# Altium schematic sheet RK3588_OSC_PLL.SchDoc
size 594 x 420 mm; SheetNumber: 3; SheetTotal: 23
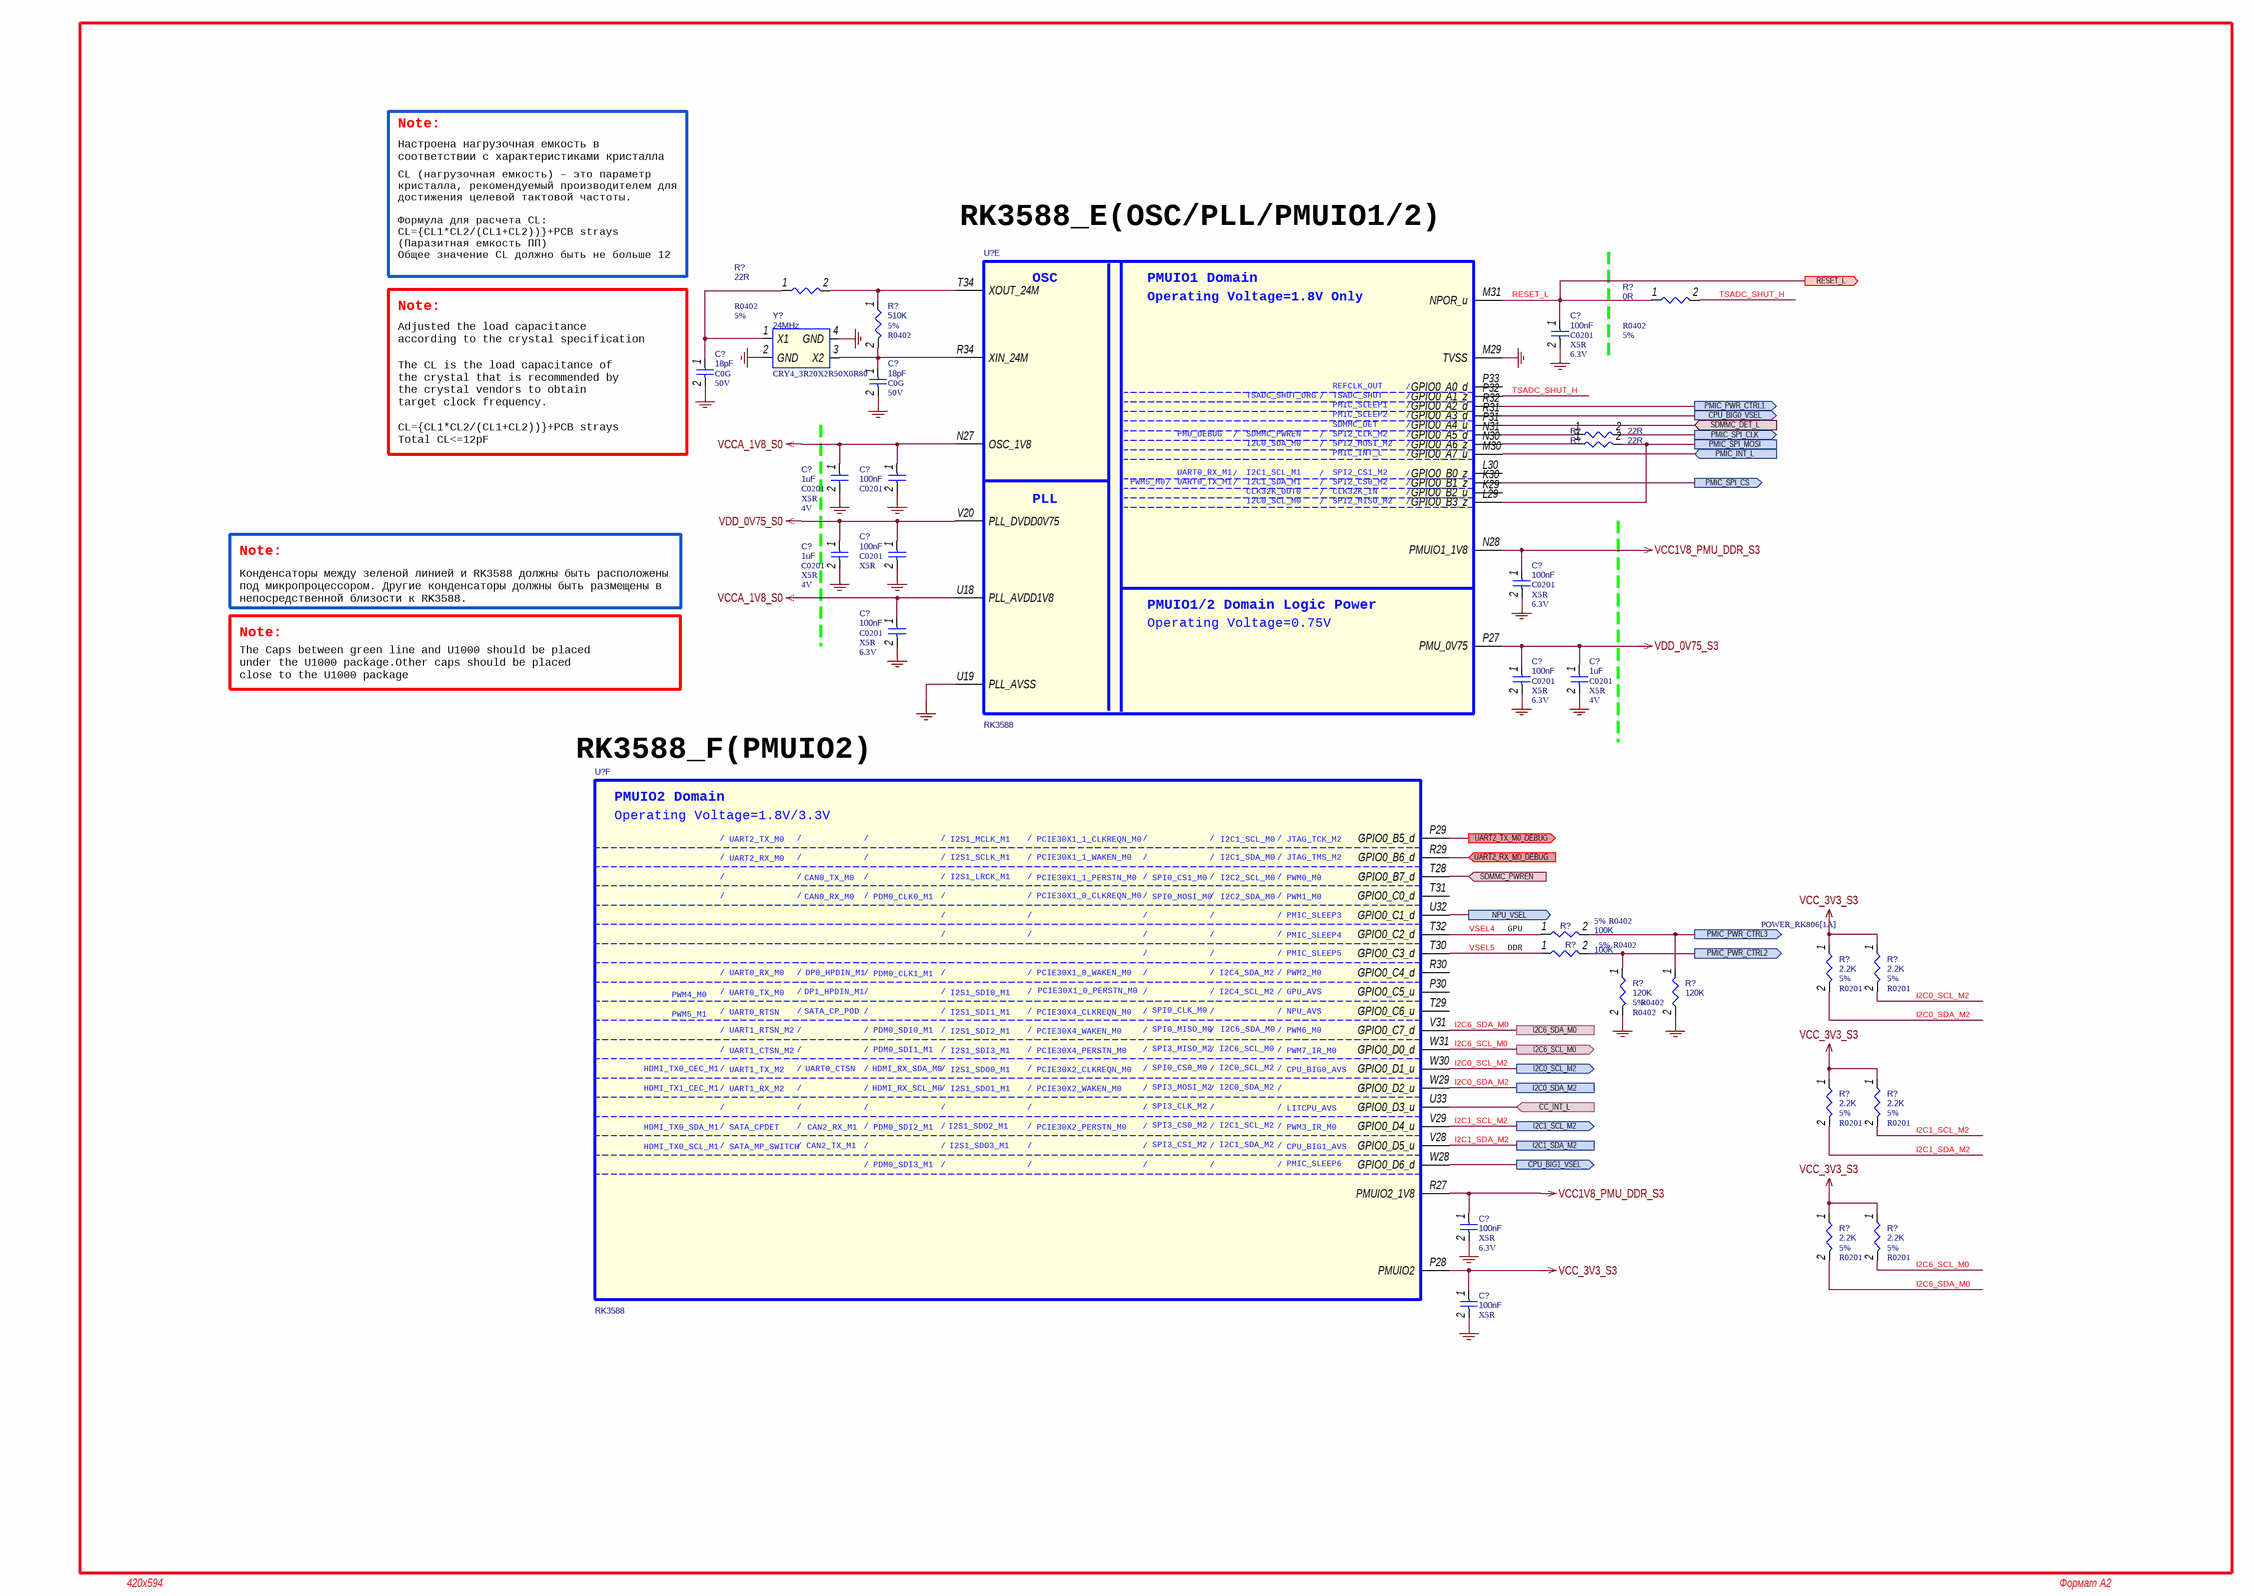
[diagram p0: RK3588_OSC_PLL.SchDoc]

## Parts
(Parts that share a designator on the sheet are numbered #1, #2 ... from top to bottom, then left to right.)
C?#1  100nF  Dielectric: X5R  Voltage: 6.3V  [C0201]
C?#2  18pF  Dielectric: C0G  Voltage: 50V  [C0402]
C?#3  18pF  Dielectric: C0G  Voltage: 50V  [C0402]
C?#4  1uF  Dielectric: X5R  Voltage: 4V  [C0201]
C?#5  100nF  [C0201]
C?#6  1uF  Dielectric: X5R  Voltage: 4V  [C0201]
C?#7  100nF  Dielectric: X5R  [C0201]
C?#8  100nF  Dielectric: X5R  Voltage: 6.3V  [C0201]
C?#9  100nF  Dielectric: X5R  Voltage: 6.3V  [C0201]
C?#10  100nF  Dielectric: X5R  Voltage: 6.3V  [C0201]
C?#11  1uF  Dielectric: X5R  Voltage: 4V  [C0201]
C?#12  100nF  Dielectric: X5R  Voltage: 6.3V  [C0201]
C?#13  100nF  Dielectric: X5R  [C0201]
R?#1  22R  Tolerance: 5%  [R0402]
R?#2  510K  Tolerance: 5%  [R0402]
R?#3  0R  Tolerance: 5%  [R0402]
R?#4  22R  [R0402]
R?#5  22R  [R0402]
R?#6  100K  Tolerance: 5%  [R0402]
R?#7  2.2K  Tolerance: 5%  PCB Footprint: R0201  [R0402]
R?#8  2.2K  Tolerance: 5%  PCB Footprint: R0201  [R0402]
R?#9  100K  Tolerance: 5%  [R0402]
R?#10  120K  Tolerance: 5%  [R0402]
R?#11  120K  [R0402]
R?#12  2.2K  Tolerance: 5%  PCB Footprint: R0201  [R0402]
R?#13  2.2K  Tolerance: 5%  PCB Footprint: R0201  [R0402]
R?#14  2.2K  Tolerance: 5%  PCB Footprint: R0201  [R0402]
R?#15  2.2K  Tolerance: 5%  PCB Footprint: R0201  [R0402]
U?#1  RK3588  [BGA1088_23R00X23R00X2R00]  (part E of 26)
U?#2  RK3588  [BGA1088_23R00X23R00X2R00]  (part F of 26)
Y?  24MHz  PCB Footprint: CRY4_3R20X2R50X0R80  [CRY-3225]

## Ports
CC_INT_L (in, see PORT_TYPE_C[2D]), CPU_BIG0_VSEL (out, see POWER_RK806[1A]), CPU_BIG1_VSEL (out, see POWER_RK806[1A]), I2C0_SCL_M2 (out, see POWER_RK806[1A]), I2C0_SDA_M2 (see POWER_RK806[1A]), I2C1_SCL_M2 (out, see POWER_RK806[1A]), I2C1_SDA_M2 (see POWER_RK806[1A]), I2C6_SCL_M0 (out, see PORT_TYPE_C[2D]), I2C6_SDA_M0 (see PORT_TYPE_C[2D]), NPU_VSEL (out, see POWER_RK806[1A]), PMIC_INT_L (in, see POWER_RK806[1A]), PMIC_PWR_CTRL1 (out, see POWER_RK806[1A]), PMIC_PWR_CTRL2 (out, see POWER_RK806[1A]), PMIC_PWR_CTRL3 (out, see POWER_RK806[1A]), PMIC_SPI_CLK (out, see POWER_RK806[1A]), PMIC_SPI_CS (out, see POWER_RK806[1A]), PMIC_SPI_MOSI (see POWER_RK806[1A]), RESET_L (out, see BUTTON[2B], POWER_RK806[1A]), SDMMC_DET_L (in, see FLASH_SD_CARD[2C]), SDMMC_PWREN (in, see FLASH_SD_CARD[2A]), UART2_RX_M0_DEBUG (in, see UART_DEBUG[2B]), UART2_TX_M0_DEBUG (out, see UART_DEBUG[2B])

## Nets
GND: C?#1.2 C?#2.2 C?#3.2 C?#4.2 C?#5.2 C?#6.2 C?#7.2 C?#8.2 C?#9.2 C?#10.2 C?#11.2 C?#12.2 C?#13.2 R?#10.2 R?#11.2 U?#1.M29(TVSS) U?#1.U19(PLL_AVSS) Y?.2(GND) Y?.4(GND)
VCC1V8_PMU_DDR_S3: C?#8.1 C?#12.1 U?#1.N28(PMUIO1_1V8) U?#2.R27(PMUIO2_1V8)
VCC_3V3_S3: C?#13.1 R?#7.1 R?#8.1 R?#12.1 R?#13.1 R?#14.1 R?#15.1 U?#2.P28(PMUIO2)
VCCA_1V8_S0: C?#4.1 C?#5.1 C?#9.1 U?#1.N27(OSC_1V8) U?#1.U18(PLL_AVDD1V8)
VDD_0V75_S0: C?#6.1 C?#7.1 U?#1.V20(PLL_DVDD0V75)
VDD_0V75_S3: C?#10.1 C?#11.1 U?#1.P27(PMU_0V75)
CC_INT_L: U?#2.U33(GPIO0_D3_u) ; port CC_INT_L
CPU_BIG0_VSEL: U?#1.R31(GPIO0_A3_d) ; port CPU_BIG0_VSEL
CPU_BIG1_VSEL: U?#2.W28(GPIO0_D6_d) ; port CPU_BIG1_VSEL
I2C0_SCL_M2: R?#8.2 U?#2.W30(GPIO0_D1_u) ; port I2C0_SCL_M2
I2C0_SDA_M2: R?#7.2 U?#2.W29(GPIO0_D2_u) ; port I2C0_SDA_M2
I2C1_SCL_M2: R?#13.2 U?#2.V29(GPIO0_D4_u) ; port I2C1_SCL_M2
I2C1_SDA_M2: R?#12.2 U?#2.V28(GPIO0_D5_u) ; port I2C1_SDA_M2
I2C6_SCL_M0: R?#15.2 U?#2.W31(GPIO0_D0_d) ; port I2C6_SCL_M0
I2C6_SDA_M0: R?#14.2 U?#2.V31(GPIO0_C7_d) ; port I2C6_SDA_M0
NPU_VSEL: U?#2.U32(GPIO0_C1_d) ; port NPU_VSEL
PMIC_INT_L: U?#1.M30(GPIO0_A7_u) ; port PMIC_INT_L
PMIC_PWR_CTRL1: U?#1.R32(GPIO0_A2_d) ; port PMIC_PWR_CTRL1
PMIC_PWR_CTRL2: R?#9.2 R?#10.1 ; port PMIC_PWR_CTRL2
PMIC_PWR_CTRL3: R?#6.2 R?#11.1 ; port PMIC_PWR_CTRL3
PMIC_SPI_CLK: R?#4.2 ; port PMIC_SPI_CLK
PMIC_SPI_CS: U?#1.K30(GPIO0_B1_z) ; port PMIC_SPI_CS
PMIC_SPI_MOSI: R?#5.2 U?#1.L29(GPIO0_B3_z) ; port PMIC_SPI_MOSI
RESET_L: C?#1.1 R?#3.1 U?#1.M31(NPOR_u) ; port RESET_L
SDMMC_DET_L: U?#1.P31(GPIO0_A4_u) ; port SDMMC_DET_L
SDMMC_PWREN: U?#2.T28(GPIO0_B7_d) ; port SDMMC_PWREN
TSADC_SHUT_H: R?#3.2 U?#1.P32(GPIO0_A1_z)
UART2_RX_M0_DEBUG: U?#2.R29(GPIO0_B6_d) ; port UART2_RX_M0_DEBUG
UART2_TX_M0_DEBUG: U?#2.P29(GPIO0_B5_d) ; port UART2_TX_M0_DEBUG
VSEL4: R?#6.1 U?#2.T32(GPIO0_C2_d)
VSEL5: R?#9.1 U?#2.T30(GPIO0_C3_d)
NetC?#2_1: C?#2.1 R?#1.1 Y?.1(X1)
NetC?#3_1: C?#3.1 R?#2.2 U?#1.R34(XIN_24M) Y?.3(X2)
NetR?#1_2: R?#1.2 R?#2.1 U?#1.T34(XOUT_24M)
NetR?#4_1: R?#4.1 U?#1.N31(GPIO0_A5_d)
NetR?#5_1: R?#5.1 U?#1.N30(GPIO0_A6_z)

Not connected (* = marked no-connect by the designer): U?#1 K29(GPIO0_B2_u) L30(GPIO0_B0_z) P33(GPIO0_A0_d); U?#2 P30(GPIO0_C5_u) R30(GPIO0_C4_d) T29(GPIO0_C6_u) T31(GPIO0_C0_d)

## Notes on the sheet
- Настроена нагрузочная емкость в соответствии с характеристиками кристалла
- Note:
- CL (нагрузочная емкость) – это параметр кристалла, рекомендуемый производителем для достижения целевой тактовой частоты.
  Формула для расчета CL:
  CL={CL1*CL2/(CL1+CL2))}+PCB strays      (Паразитная емкость ПП)
  Общее значение CL должно быть не больше 12 пФ.
- RK3588_E(OSC/PLL/PMUIO1/2)
- (near C?#2) Adjusted the load capacitance
  according to the crystal specification
- (near C?#2) The CL is the load capacitance of
  the crystal that is recommended by
  the crystal vendors to obtain
  target clock frequency.
  CL={CL1*CL2/(CL1+CL2))}+PCB strays
  Total CL<=12pF
- Конденсаторы между зеленой линией и RK3588 должны быть расположены под микропроцессором. Другие конденсаторы должны быть размещены в непосредственной близости к RK3588.
- The Caps between green line and U1000 should be placed
  under the U1000 package.Other caps should be placed
  close to the U1000 package
- RK3588_F(PMUIO2)
- (near R?#6) GPU
- (near R?#9) DDR
- 420x594
- Формат А2
- (in symbol SOC_RK3588, part E) OSC; PMUIO1 Domain; Operating Voltage=1.8V Only; REFCLK_OUT; /; TSADC_SHUT_ORG; TSADC_SHUT; PMIC_SLEEP1; PMIC_SLEEP2; SDMMC_DET; PMU_DEBUG; SDMMC_PWREN; SPI2_CLK_M2; I2C0_SDA_M0; SPI2_MOSI_M2; PMIC_INT_L; UART0_RX_M1; I2C1_SCL_M1; SPI2_CS1_M2; PWM5_M0; UART0_TX_M1; I2C1_SDA_M1; SPI2_CS0_M2; CLK32K_OUT0; CLK32K_IN; PLL; I2C0_SCL_M0; SPI2_MISO_M2; PMUIO1/2 Domain Logic Power; Operating Voltage=0.75V
- (in symbol SOC_RK3588, part F) PMUIO2 Domain; Operating Voltage=1.8V/3.3V; /; UART2_TX_M0; I2S1_MCLK_M1; PCIE30X1_1_CLKREQN_M0; I2C1_SCL_M0; JTAG_TCK_M2; UART2_RX_M0; I2S1_SCLK_M1; PCIE30X1_1_WAKEN_M0; I2C1_SDA_M0; JTAG_TMS_M2; CAN0_TX_M0; I2S1_LRCK_M1; PCIE30X1_1_PERSTN_M0; SPI0_CS1_M0; I2C2_SCL_M0; PWM0_M0; CAN0_RX_M0; PDM0_CLK0_M1; PCIE30X1_0_CLKREQN_M0; SPI0_MOSI_M0; I2C2_SDA_M0; PWM1_M0; PMIC_SLEEP3; PMIC_SLEEP4; PMIC_SLEEP5; UART0_RX_M0; DP0_HPDIN_M1; PDM0_CLK1_M1; PCIE30X1_0_WAKEN_M0; I2C4_SDA_M2; PWM2_M0; UART0_TX_M0; DP1_HPDIN_M1; I2S1_SDI0_M1; PCIE30X1_0_PERSTN_M0; I2C4_SCL_M2; GPU_AVS; PWM4_M0; UART0_RTSN; SATA_CP_POD; I2S1_SDI1_M1; PCIE30X4_CLKREQN_M0; SPI0_CLK_M0; NPU_AVS; PWM5_M1; UART1_RTSN_M2; PDM0_SDI0_M1; I2S1_SDI2_M1; PCIE30X4_WAKEN_M0; SPI0_MISO_M0; I2C6_SDA_M0; PWM6_M0; UART1_CTSN_M2; PDM0_SDI1_M1; I2S1_SDI3_M1; PCIE30X4_PERSTN_M0; SPI3_MISO_M2; I2C6_SCL_M0; PWM7_IR_M0; HDMI_TX0_CEC_M1; UART1_TX_M2; UART0_CTSN; HDMI_RX_SDA_M0; I2S1_SDO0_M1; PCIE30X2_CLKREQN_M0; SPI0_CS0_M0; I2C0_SCL_M2; CPU_BIG0_AVS; HDMI_TX1_CEC_M1; UART1_RX_M2; HDMI_RX_SCL_M0; I2S1_SDO1_M1; PCIE30X2_WAKEN_M0; SPI3_MOSI_M2; I2C0_SDA_M2; SPI3_CLK_M2; LITCPU_AVS; HDMI_TX0_SDA_M1; SATA_CPDET; CAN2_RX_M1; PDM0_SDI2_M1; I2S1_SDO2_M1; PCIE30X2_PERSTN_M0; SPI3_CS0_M2; I2C1_SCL_M2; PWM3_IR_M0; HDMI_TX0_SCL_M1; SATA_MP_SWITCH; CAN2_TX_M1; I2S1_SDO3_M1; SPI3_CS1_M2; I2C1_SDA_M2; CPU_BIG1_AVS; PDM0_SDI3_M1; PMIC_SLEEP6

## Library data of the parts
C?#1 = CAP NP_Dup1: cap,100.00nF,+/-10%,6.3V,X5R,C0201; Part Reference: C1100; Manufacturer: TDK; RK PN: C0603X5R0J104K030BC; Priority: A; Tolerance: 10%; PCB Footprint: C0201; Value: 100nF; Part Type: C0201; Manufacturer PN: C0603X5R0J104K030BC; Created by: JJJ
C?#2 = CAP NP_Dup1: cap,18.00pF,+/-5%,50V,C0G,C0402; Part Reference: C1101; Manufacturer: TDK; Number: 37; RK PN: C1005C0G1H180J050BA; Priority: A; Tolerance: 5%; C_Voltage: 6.3V; Value: 18pF; Part Type: C0402; Manufacturer PN: C1005C0G1H180J050BA; Created by: JJJ
C?#3 = CAP NP_Dup1: cap,18.00pF,+/-5%,50V,C0G,C0402; Part Reference: C1102; Manufacturer PN: C1005C0G1H180J050BA; Manufacturer: TDK; C_Voltage: 6.3V; Tolerance: 5%; Priority: A; Number: 37; Value: 18pF; Created by: JJJ; Part Type: C0402; RK PN: C1005C0G1H180J050BA
C?#4 = CAP NP_Dup1: cap,1.00uF,+/-20%,4V,X5R,C0201; Part Reference: C1103; Manufacturer: TDK; RK PN: C0603X5R0G105M030BC; Priority: A; Tolerance: 20%; PCB Footprint: C0201; Value: 1uF; Part Type: C0201; Manufacturer PN: C0603X5R0G105M030BC; Created by: JJJ
C?#5 = CAP NP_Dup1: cap,100.00nF,+/-10%,6.3V,X5R,C0201; Part Reference: C1104; Manufacturer PN: C0603X5R0J104K030BC; Manufacturer: TDK; Tolerance: 10%; Priority: A; PCB Footprint: C0201; Value: 100nF; Created by: JJJ; Part Type: C0201; RK PN: C0603X5R0J104K030BC
C?#6 = CAP NP_Dup1: cap,1.00uF,+/-20%,4V,X5R,C0201; Part Reference: C1105; Manufacturer PN: C0603X5R0G105M030BC; Manufacturer: TDK; Tolerance: 20%; Priority: A; PCB Footprint: C0201; Value: 1uF; Created by: JJJ; Part Type: C0201; RK PN: C0603X5R0G105M030BC
C?#7 = CAP NP_Dup1: cap,100.00nF,+/-10%,6.3V,X5R,C0201; Part Reference: C1106; Manufacturer: TDK; RK PN: C0603X5R0J104K030BC; Priority: A; Tolerance: 10%; PCB Footprint: C0201; Value: 100nF; Part Type: C0201; Manufacturer PN: C0603X5R0J104K030BC; Created by: JJJ
C?#8 = CAP NP_Dup1: cap,100.00nF,+/-10%,6.3V,X5R,C0201; Part Reference: C1107; Manufacturer: TDK; RK PN: C0603X5R0J104K030BC; Priority: A; Tolerance: 10%; PCB Footprint: C0201; Value: 100nF; Part Type: C0201; Manufacturer PN: C0603X5R0J104K030BC; Created by: JJJ
C?#9 = CAP NP_Dup1: cap,100.00nF,+/-10%,6.3V,X5R,C0201; Part Reference: C1109; Manufacturer: TDK; RK PN: C0603X5R0J104K030BC; Priority: A; Tolerance: 10%; PCB Footprint: C0201; Value: 100nF; Part Type: C0201; Manufacturer PN: C0603X5R0J104K030BC; Created by: JJJ
C?#10 = CAP NP_Dup1: cap,100.00nF,+/-10%,6.3V,X5R,C0201; Part Reference: C1110; Manufacturer: TDK; RK PN: C0603X5R0J104K030BC; Priority: A; Tolerance: 10%; PCB Footprint: C0201; Value: 100nF; Part Type: C0201; Manufacturer PN: C0603X5R0J104K030BC; Created by: JJJ
C?#11 = CAP NP_Dup1: cap,1.00uF,+/-20%,4V,X5R,C0201; Part Reference: C1111; Manufacturer PN: C0603X5R0G105M030BC; Manufacturer: TDK; Tolerance: 20%; Priority: A; PCB Footprint: C0201; Value: 1uF; Created by: JJJ; Part Type: C0201; RK PN: C0603X5R0G105M030BC
C?#12 = CAP NP_Dup1: cap,100.00nF,+/-10%,6.3V,X5R,C0201; Part Reference: C1112; Manufacturer: TDK; RK PN: C0603X5R0J104K030BC; Priority: A; Tolerance: 10%; Value: 100nF; Part Type: C0201; Manufacturer PN: C0603X5R0J104K030BC; Created by: JJJ
C?#13 = CAP NP_Dup1: cap,100.00nF,+/-10%,6.3V,X5R,C0201; Part Reference: C1113; Manufacturer PN: C0603X5R0J104K030BC; Manufacturer: TDK; Tolerance: 10%; Priority: A; Value: 100nF; Created by: JJJ; Part Type: C0201; RK PN: C0603X5R0J104K030BC
R?#1 = RESISTOR_Dup2: НЁУГєсД¤µзЧи,22R,+/-5%,R0402,1/16W.; Part Reference: R1101; Manufacturer PN: RC0402JR-0722RL; Manufacturer: YAGEO; Wattage: 1/16W; Priority: A; PCB Footprint: R0402; Value: 22R; Created by: YTL; Part Type: НЁУГєсД¤µзЧи; RK PN: RC0402JR-0722RL
R?#2 = RESISTOR_Dup2: НЁУГєсД¤µзЧи,510K,+/-5%,R0402,1/16W.; Part Reference: R1103; Manufacturer PN: RC0402JR-07510KL; Manufacturer: YAGEO; Wattage: 1/16W; Priority: A; PCB Footprint: R0402; Value: 510K; Created by: YTL; Part Type: НЁУГєсД¤µзЧи; RK PN: RC0402JR-07510KL
R?#3 = RESISTOR_Dup2: НЁУГєсД¤µзЧи,0R,+/-5%,R0402,1/16W.; Part Reference: R1100; Manufacturer PN: RC0402JR-070RL; Manufacturer: YAGEO; Wattage: 1/16W; Priority: A; PCB Footprint: R0402; Value: 0R; Created by: YTL; Part Type: НЁУГєсД¤µзЧи; RK PN: RC0402JR-070RL
R?#4 = RESISTOR_Dup2: НЁУГєсД¤µзЧи,22R,+/-5%,R0402,1/16W.; Part Reference: R1104; Manufacturer PN: RC0402JR-0722RL; Manufacturer: YAGEO; Wattage: 1/16W; Priority: A; Value: 22R; Created by: YTL; Part Type: НЁУГєсД¤µзЧи; RK PN: RC0402JR-0722RL
R?#5 = RESISTOR_Dup2: НЁУГєсД¤µзЧи,22R,+/-5%,R0402,1/16W.; Part Reference: R1107; Manufacturer: YAGEO; RK PN: RC0402JR-0722RL; Priority: A; Wattage: 1/16W; Value: 22R; Part Type: НЁУГєсД¤µзЧи; Manufacturer PN: RC0402JR-0722RL; Created by: YTL
R?#6 = RESISTOR_Dup2: НЁУГєсД¤µзЧи,100K,+/-5%,R0402,1/16W.; Part Reference: R1109; Manufacturer: YAGEO; RK PN: RC0402JR-07100KL; Priority: A; Wattage: 1/16W; PCB Footprint: R0402; Value: 100K; Part Type: НЁУГєсД¤µзЧи; Manufacturer PN: RC0402JR-07100KL; Created by: YTL
R?#7 = RESISTOR_Dup2: НЁУГєсД¤µзЧи,2K2,+/-5%,R0201,1/20W.; Part Reference: R1139; Manufacturer PN: RC0201JR-072K2L; Manufacturer: YAGEO; Wattage: 1/20W; Priority: A; Value: 2.2K; Created by: YTL; Part Type: НЁУГєсД¤µзЧи; RK PN: RC0201JR-072K2L
R?#8 = RESISTOR_Dup2: НЁУГєсД¤µзЧи,2K2,+/-5%,R0201,1/20W.; Part Reference: R1140; Manufacturer PN: RC0201JR-072K2L; Manufacturer: YAGEO; Wattage: 1/20W; Priority: A; Value: 2.2K; Created by: YTL; Part Type: НЁУГєсД¤µзЧи; RK PN: RC0201JR-072K2L
R?#9 = RESISTOR_Dup2: НЁУГєсД¤µзЧи,100K,+/-5%,R0402,1/16W.; Part Reference: R1115; Manufacturer PN: RC0402JR-07100KL; Manufacturer: YAGEO; Wattage: 1/16W; Priority: A; PCB Footprint: R0402; Value: 100K; Created by: YTL; Part Type: НЁУГєсД¤µзЧи; RK PN: RC0402JR-07100KL
R?#10 = RESISTOR_Dup2: НЁУГєсД¤µзЧи,120K,+/-5%,R0402,1/16W.; Part Reference: R1116; Manufacturer PN: RC0402JR-07120KL; Manufacturer: YAGEO; Wattage: 1/16W; Priority: A; PCB Footprint: R0402; Value: 120K; Created by: YTL; Part Type: НЁУГєсД¤µзЧи; RK PN: RC0402JR-07120KL
R?#11 = RESISTOR_Dup2: НЁУГєсД¤µзЧи,120K,+/-5%,R0402,1/16W.; Part Reference: R1110; Manufacturer PN: RC0402JR-07120KL; Manufacturer: YAGEO; Tolerance: 5%; Priority: A; Wattage: 1/16W; PCB Footprint: R0402; Value: 120K; Created by: YTL; Part Type: НЁУГєсД¤µзЧи; RK PN: RC0402JR-07120KL
R?#12 = RESISTOR_Dup2: НЁУГєсД¤µзЧи,2K2,+/-5%,R0201,1/20W.; Part Reference: R1113; Manufacturer PN: RC0201JR-072K2L; Manufacturer: YAGEO; Wattage: 1/20W; Priority: A; Value: 2.2K; Created by: YTL; Part Type: НЁУГєсД¤µзЧи; RK PN: RC0201JR-072K2L
R?#13 = RESISTOR_Dup2: НЁУГєсД¤µзЧи,2K2,+/-5%,R0201,1/20W.; Part Reference: R1114; Manufacturer PN: RC0201JR-072K2L; Manufacturer: YAGEO; Wattage: 1/20W; Priority: A; Value: 2.2K; Created by: YTL; Part Type: НЁУГєсД¤µзЧи; RK PN: RC0201JR-072K2L
R?#14 = RESISTOR_Dup2: НЁУГєсД¤µзЧи,2K2,+/-5%,R0201,1/20W.; Part Reference: R1130; Manufacturer: YAGEO; RK PN: RC0201JR-072K2L; Priority: A; Wattage: 1/20W; Value: 2.2K; Part Type: НЁУГєсД¤µзЧи; Manufacturer PN: RC0201JR-072K2L; Created by: YTL
R?#15 = RESISTOR_Dup2: НЁУГєсД¤µзЧи,2K2,+/-5%,R0201,1/20W.; Part Reference: R1131; Manufacturer: YAGEO; RK PN: RC0201JR-072K2L; Priority: A; Wattage: 1/20W; Value: 2.2K; Part Type: НЁУГєсД¤µзЧи; Manufacturer PN: RC0201JR-072K2L; Created by: YTL
U?#1 U?#2 = SOC_RK3588: ROCKCHIP SOC; Part Reference: U1000; Manufacturer: Rockchip (ИрРѕОў); SWAP_INFO: (S1+S2+S3+S4+S5+S6+S7+S8+S9+S10+S11+S12+S13+S14+S15+S16+S17+S18+S19+S20+S21+S22+S23+S24+S25+S26); SPLIT_INST: TRUE; Priority: A; Value: RK3588; PCB Footprint: BGA1088_23R00X23R00X2R00; RK PN: RK3588; Part Type: SOC; Manufacturer PN: RK3588; Created by: YWQ
Y? = CRYSTAL_4P: ОЮФґѕ§ХсЈ¬24MЈ¬3225,ЎА10ppmЈ¬8pFЈ¬Hosonic; Part Reference: Y1100; Manufacturer PN: E3SB24.0000F08E11; Manufacturer: Hosonic(єиРЗµзЧУ); Priority: A; Value: 24MHz; Created by: JJJ; Part Type: CRYSTAL; RK PN: E3SB24.0000F08E11